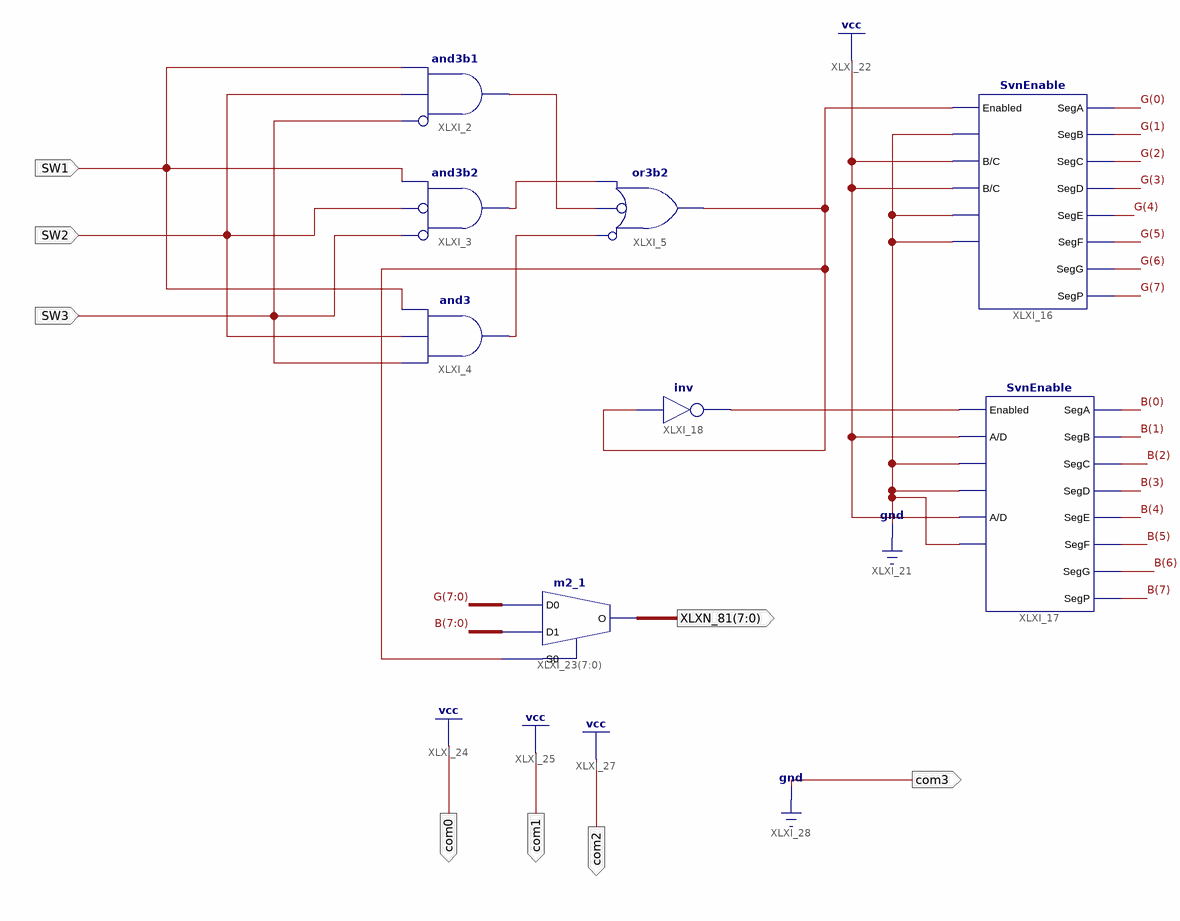
[diagram p0: schematic sheet 1]
// Xilinx ISE schematic res.sch (spartan6) as structural Verilog: 8 symbols, 8 ports
module res (
  input  SW1,
  input  SW2,
  input  SW3,
  output [7:0] XLXN_81,
  output com0,
  output com1,
  output com2,
  output com3
);

  wire XLXN_21, XLXN_22, XLXN_23, XLXN_51, XLXN_62;
  wire [7:0] B, G;

  or XLXI_5 (XLXN_62, ~XLXN_23, ~XLXN_21, XLXN_22);  // or3b2
  and XLXI_4 (XLXN_23, SW3, SW2, SW1);
  and XLXI_3 (XLXN_22, ~SW3, ~SW2, SW1);  // and3b2
  and XLXI_2 (XLXN_21, ~SW3, SW2, SW1);  // and3b1
  SvnEnable XLXI_16 (
    .A(1'b0), .B(1'b1), .C(1'b1), .D(1'b0), .Enabled(XLXN_62), .P(1'b0), .SegA(G[0]), .SegB(G[1]),
    .SegC(G[2]), .SegD(G[3]), .SegE(G[4]), .SegF(G[5]), .SegG(G[6]), .SegP(G[7]));
  SvnEnable XLXI_17 (
    .A(1'b1), .B(1'b0), .C(1'b0), .D(1'b1), .Enabled(XLXN_51), .P(1'b0), .SegA(B[0]), .SegB(B[1]),
    .SegC(B[2]), .SegD(B[3]), .SegE(B[4]), .SegF(B[5]), .SegG(B[6]), .SegP(B[7]));
  not XLXI_18 (XLXN_51, XLXN_62);
  m2_1 XLXI_23[7:0] (.D0(G), .D1(B), .S0(XLXN_62), .O(XLXN_81));

  assign com0 = 1'b1;
  assign com1 = 1'b1;
  assign com2 = 1'b1;
  assign com3 = 1'b0;
endmodule
